# EAGLE schematic mother_v0 (EAGLE 9.6.2)
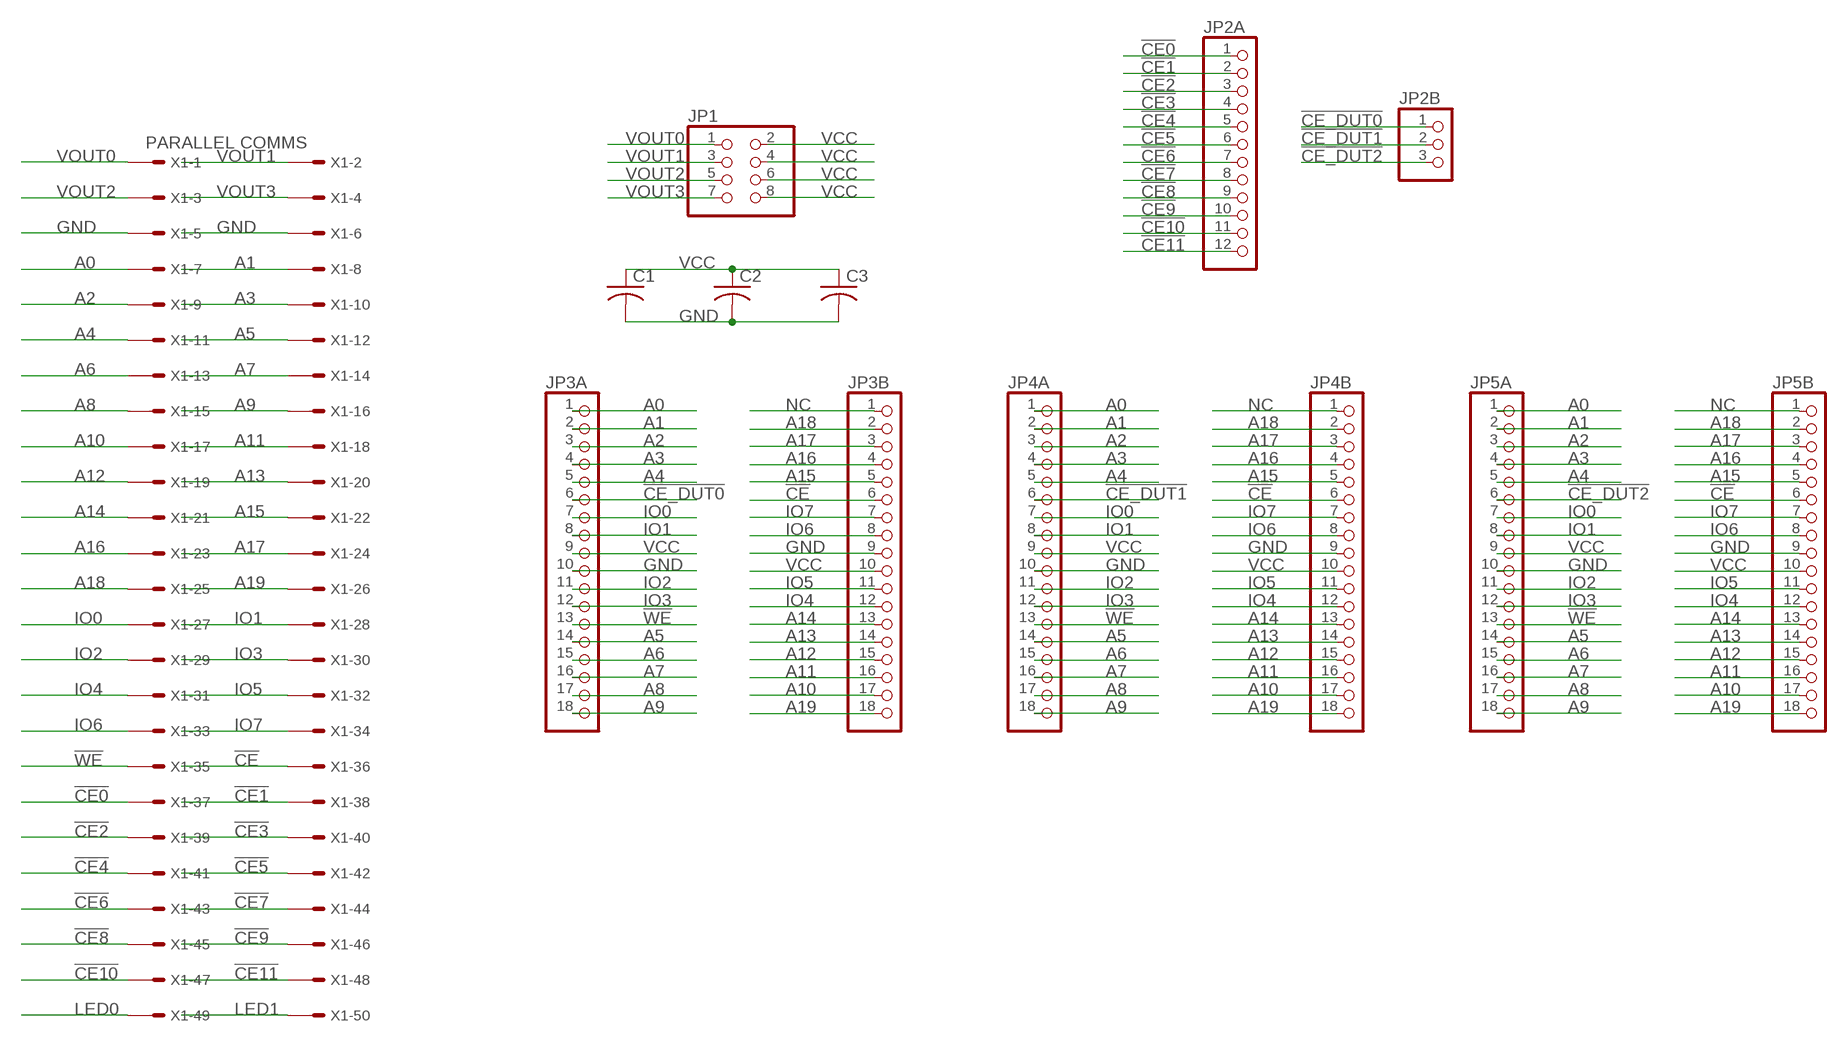
[diagram p0: schematic, sheet 1]

## Parts
C1  C-USC0805  [C0805]
C2  C-USC0805  [C0805]
C3  C-USC0805  [C0805]
JP1  PINHD-2X4  [2X04]
JP2A  PINHD-1X12  [1X12]
JP2B  PINHD-1X3  [1X03]
JP3A  PINHD-1X18  [1X18]
JP3B  PINHD-1X18  [1X18]
JP4A  PINHD-1X18  [1X18]
JP4B  PINHD-1X18  [1X18]
JP5A  PINHD-1X18  [1X18]
JP5B  PINHD-1X18  [1X18]
X1  PARALLEL COMMS  057-050-1  [057-050-1]

## Nets
!CE: JP3B.6 JP4B.6 JP5B.6 X1.36
!CE0: JP2A.1 X1.37
!CE1: JP2A.2 X1.38
!CE2: JP2A.3 X1.39
!CE3: JP2A.4 X1.40
!CE4: JP2A.5 X1.41
!CE5: JP2A.6 X1.42
!CE6: JP2A.7 X1.43
!CE7: JP2A.8 X1.44
!CE8: JP2A.9 X1.45
!CE9: JP2A.10 X1.46
!CE10: JP2A.11 X1.47
!CE11: JP2A.12 X1.48
!CE_DUT0: JP2B.1 JP3A.6
!CE_DUT1: JP2B.2 JP4A.6
!CE_DUT2: JP2B.3 JP5A.6
!WE: JP3A.13 JP4A.13 JP5A.13 X1.35
A0: JP3A.1 JP4A.1 JP5A.1 X1.7
A1: JP3A.2 JP4A.2 JP5A.2 X1.8
A2: JP3A.3 JP4A.3 JP5A.3 X1.9
A3: JP3A.4 JP4A.4 JP5A.4 X1.10
A4: JP3A.5 JP4A.5 JP5A.5 X1.11
A5: JP3A.14 JP4A.14 JP5A.14 X1.12
A6: JP3A.15 JP4A.15 JP5A.15 X1.13
A7: JP3A.16 JP4A.16 JP5A.16 X1.14
A8: JP3A.17 JP4A.17 JP5A.17 X1.15
A9: JP3A.18 JP4A.18 JP5A.18 X1.16
A10: JP3B.17 JP4B.17 JP5B.17 X1.17
A11: JP3B.16 JP4B.16 JP5B.16 X1.18
A12: JP3B.15 JP4B.15 JP5B.15 X1.19
A13: JP3B.14 JP4B.14 JP5B.14 X1.20
A14: JP3B.13 JP4B.13 JP5B.13 X1.21
A15: JP3B.5 JP4B.5 JP5B.5 X1.22
A16: JP3B.4 JP4B.4 JP5B.4 X1.23
A17: JP3B.3 JP4B.3 JP5B.3 X1.24
A18: JP3B.2 JP4B.2 JP5B.2 X1.25
A19: JP3B.18 JP4B.18 JP5B.18 X1.26
GND: C1.2 C2.2 C3.2 JP3A.10 JP3B.9 JP4A.10 JP4B.9 JP5A.10 JP5B.9 X1.5 X1.6
IO0: JP3A.7 JP4A.7 JP5A.7 X1.27
IO1: JP3A.8 JP4A.8 JP5A.8 X1.28
IO2: JP3A.11 JP4A.11 JP5A.11 X1.29
IO3: JP3A.12 JP4A.12 JP5A.12 X1.30
IO4: JP3B.12 JP4B.12 JP5B.12 X1.31
IO5: JP3B.11 JP4B.11 JP5B.11 X1.32
IO6: JP3B.8 JP4B.8 JP5B.8 X1.33
IO7: JP3B.7 JP4B.7 JP5B.7 X1.34
LED0: X1.49
LED1: X1.50
NC: JP3B.1 JP4B.1 JP5B.1
VCC: C1.1 C2.1 C3.1 JP1.2 JP1.4 JP1.6 JP1.8 JP3A.9 JP3B.10 JP4A.9 JP4B.10 JP5A.9 JP5B.10
VOUT0: JP1.1 X1.1
VOUT1: JP1.3 X1.2
VOUT2: JP1.5 X1.3
VOUT3: JP1.7 X1.4

## Library data of the parts
C1-C3 = rcl:C-US: CAPACITOR, American symbol; SPICEPREFIX: C
JP1 = pinhead:PINHD-2X4: PIN HEADER
JP2A = pinhead:PINHD-1X12: PIN HEADER
JP2B = pinhead:PINHD-1X3: PIN HEADER
JP3A JP3B JP4A JP4B JP5A JP5B = pinhead:PINHD-1X18: PIN HEADER
X1 = con-panduit:057-050-: CONNECTOR 50-pin series 057 contact pc board low profile headers; OC_FARNELL: unknown; OC_NEWARK: unknown

## Net classes
2 lowpower: width 0.305 mm, drill 0.483 mm